# EasyEDA Pro project smart-switch-v1.eprj

# Schematic smart-switch-20a-main-board

## Sheets
1 main-board: Board Name: smart-switch-20a-main-board-v1; Create Date: 2025-08-24; Page Name: main-board; Project Name: smart-switch-v1; Schematic Name: smart-switch-20a-main-board; Update Date: 2025-09-30; Version: V1.0
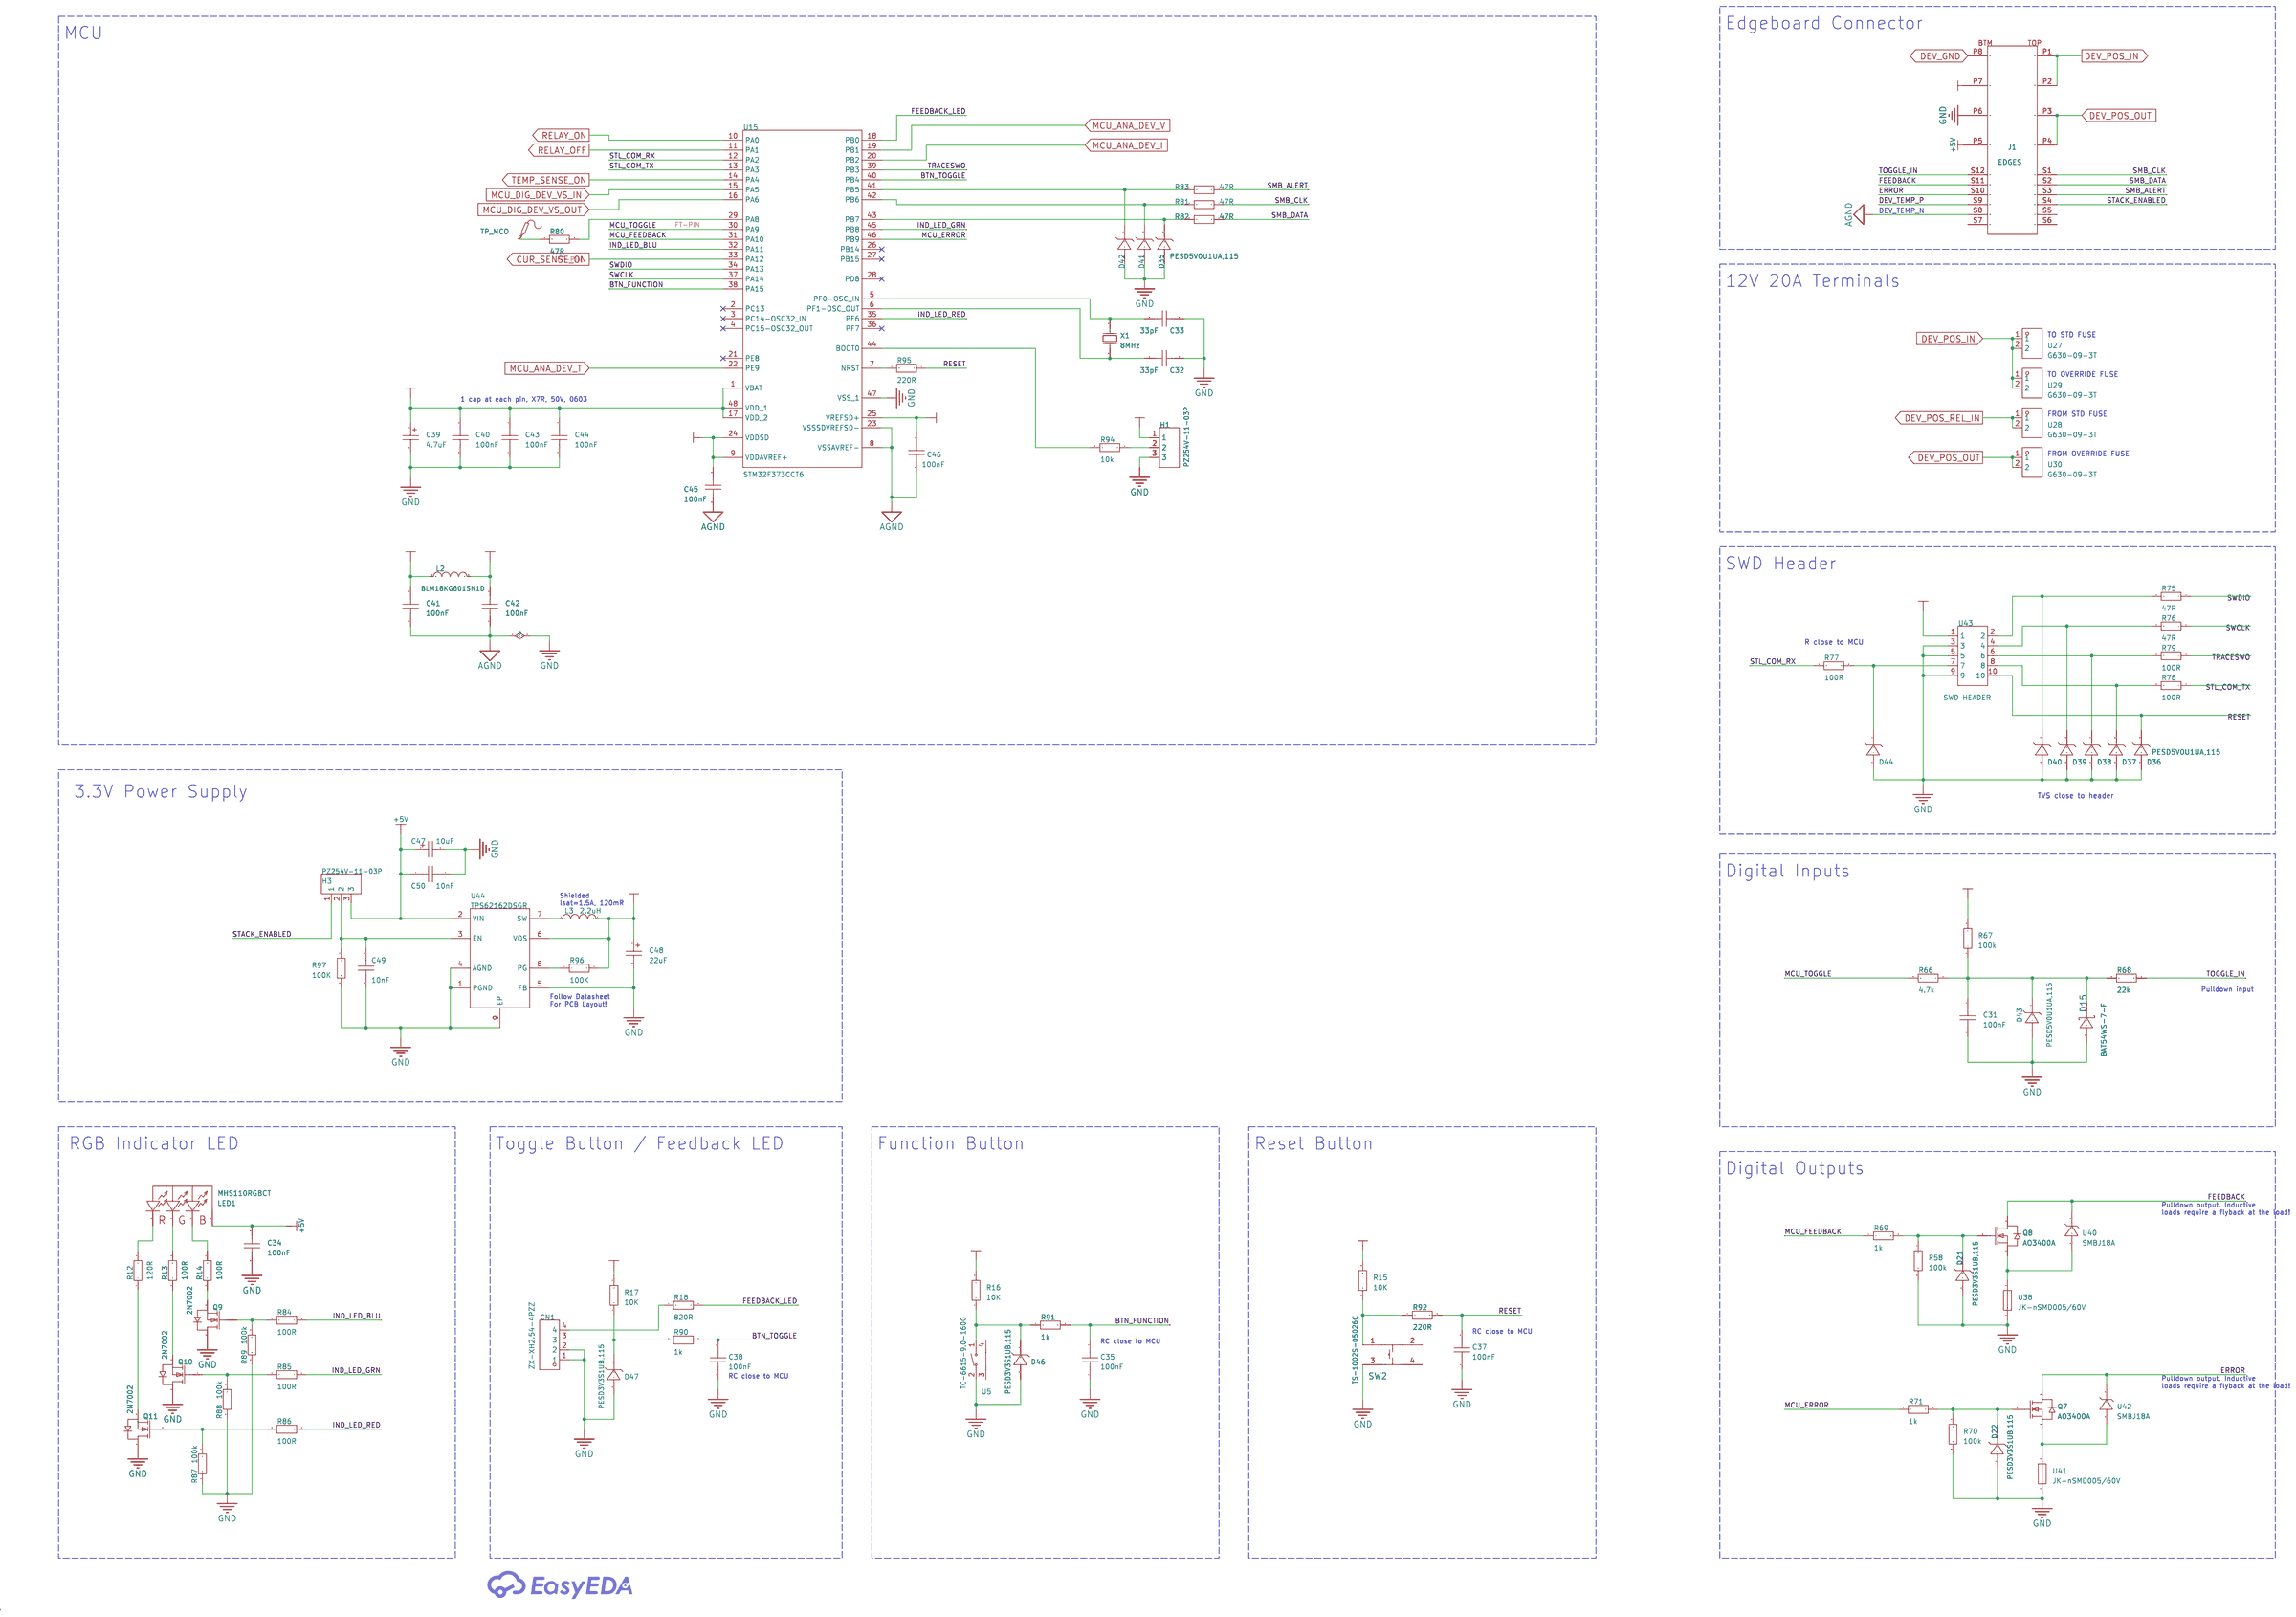
[diagram p0: main-board]
2 modules: Create Date: 2025-08-25; Page Name: modules; Update Date: 2025-09-28; Company: EasyEDA.com; Page Size: A4
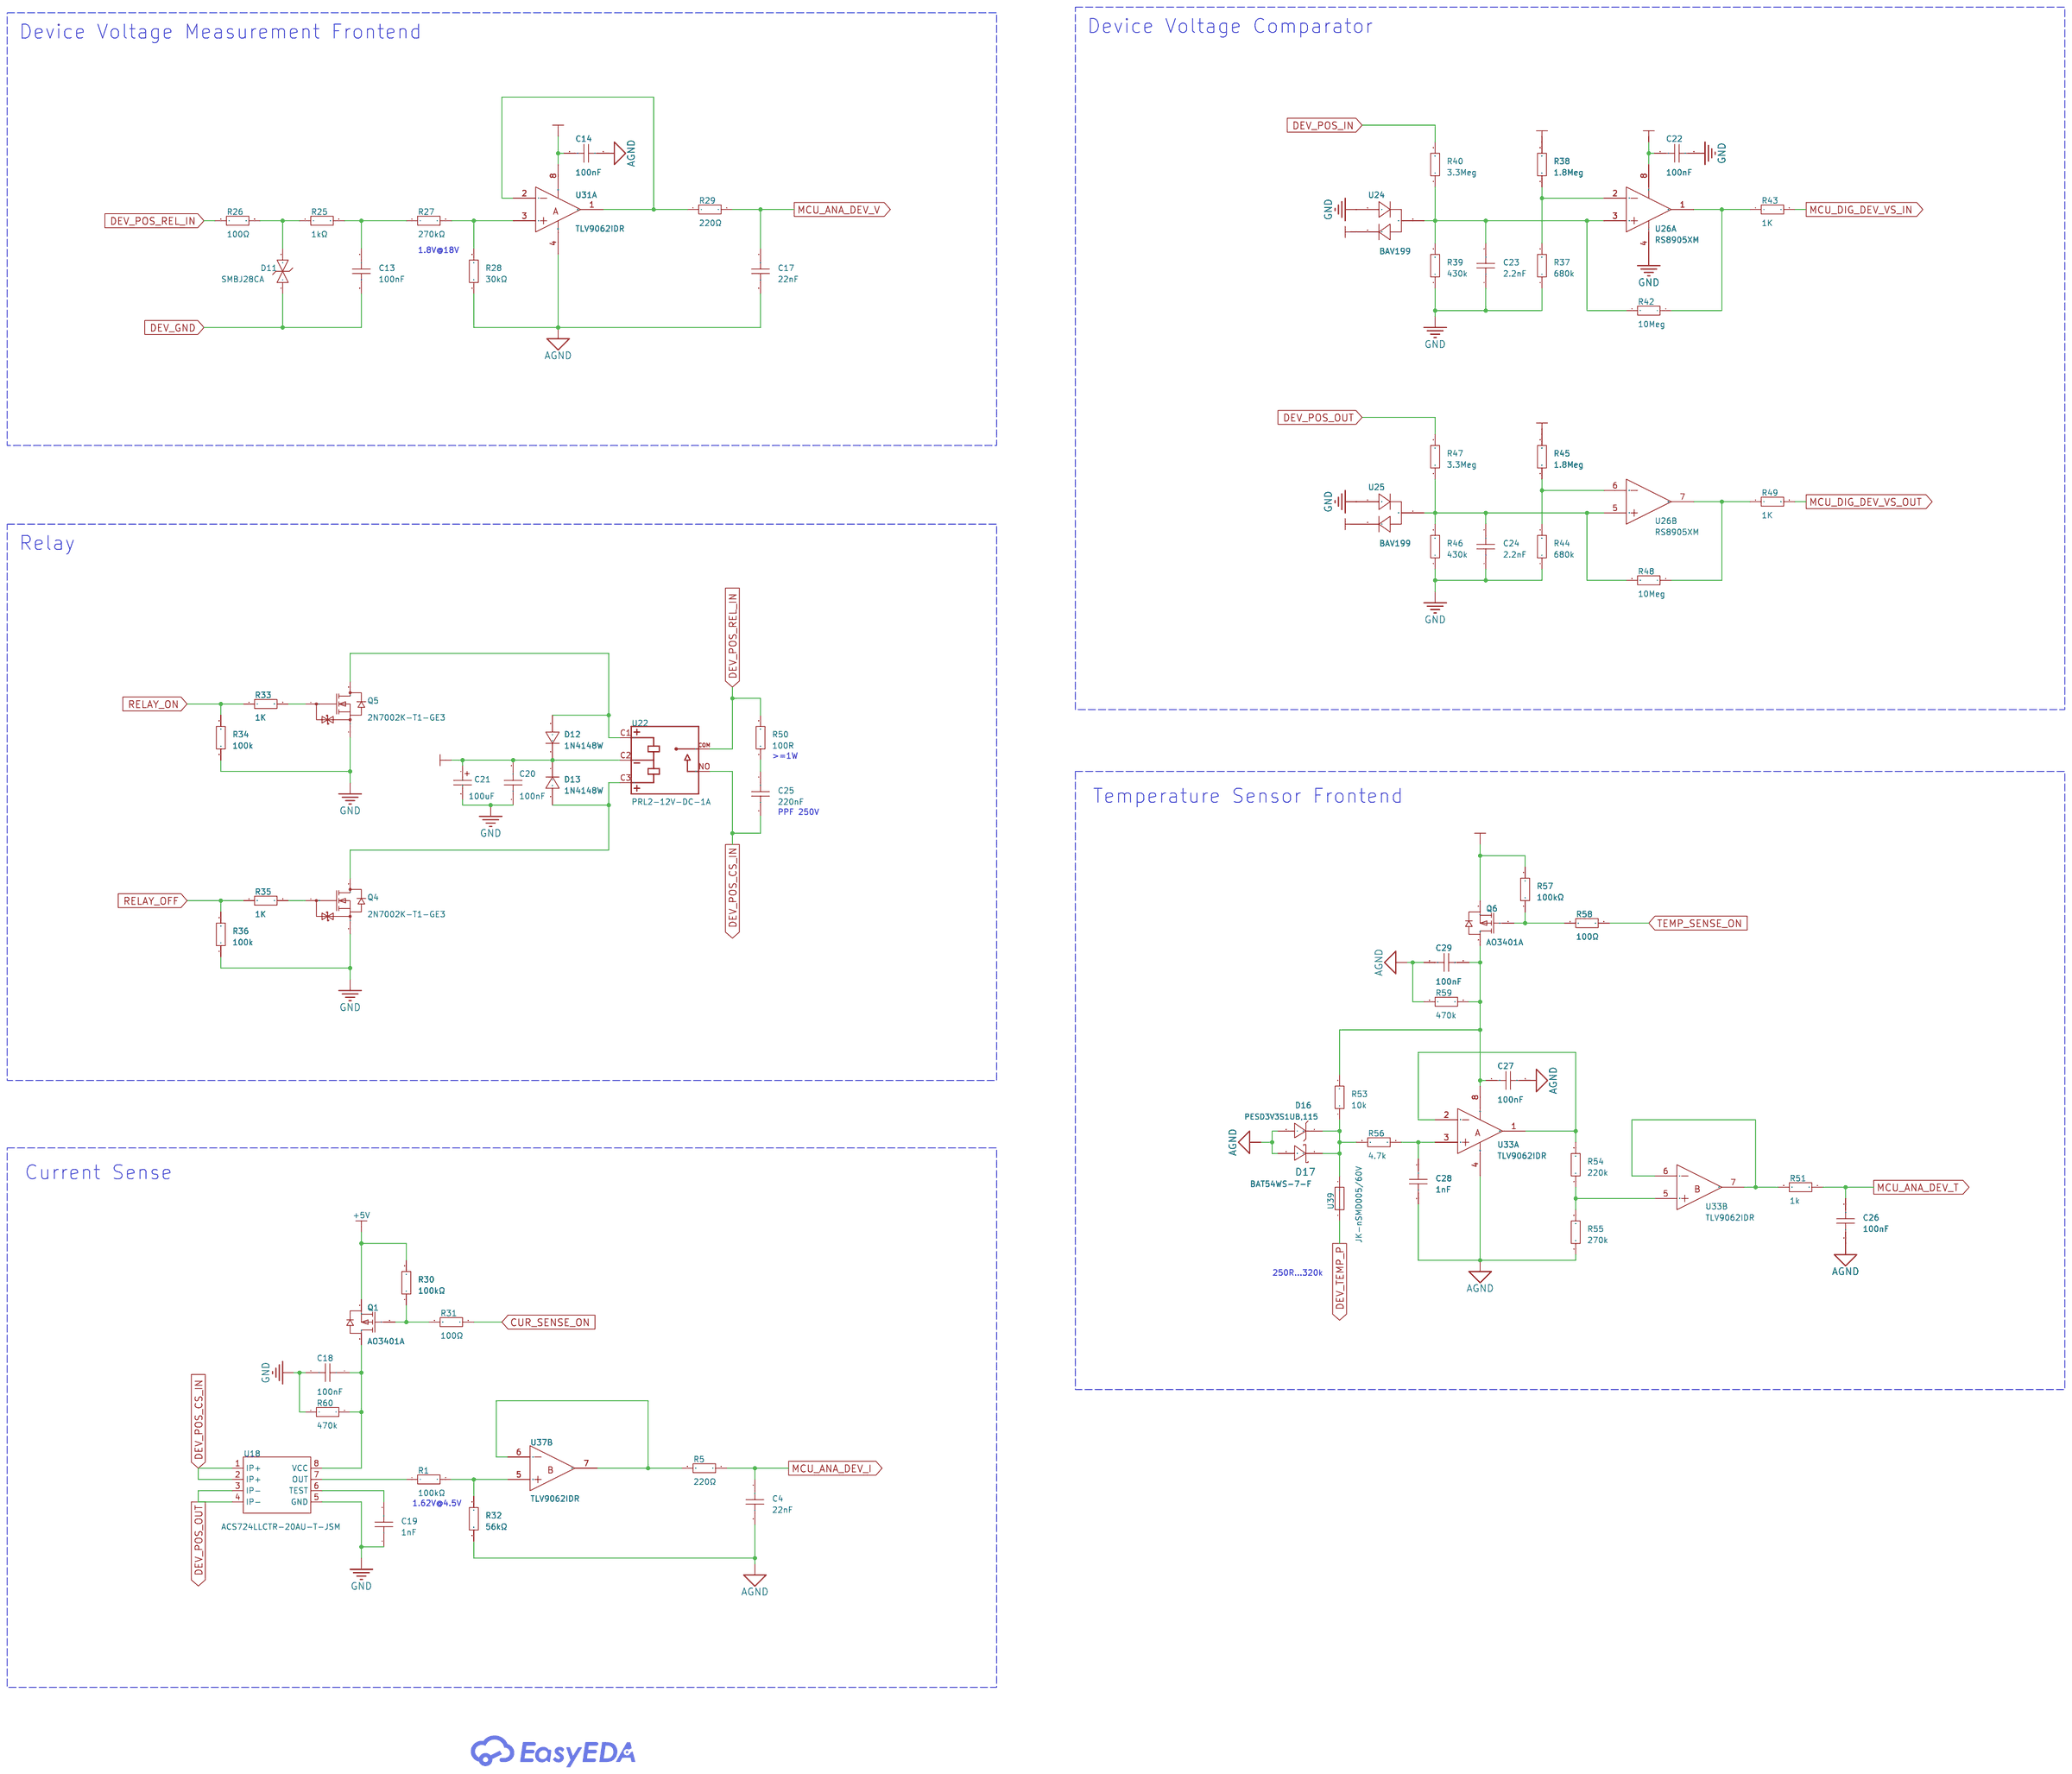
[diagram p1: modules]

## Parts
sheet main-board
C31  100nF  [C0201]
C32  33pF  [C0201]
C33  33pF  [C0201]
C34  100nF  [C0201]
C35  100nF  [C0201]
C37  100nF  [C0201]
C38  100nF  [C0201]
C39  4.7uF  [CAP-SMD_BD3.0-L3.3-W3.3-RD]
C40  100nF  [C0201]
C41  100nF  [C0201]
C42  100nF  [C0201]
C43  100nF  [C0201]
C44  100nF  [C0201]
C45  100nF  [C0201]
C46  100nF  [C0201]
C47  10uF  [CAP-SMD_BD3.0-L3.3-W3.3-RD]
C48  22uF  [CAP-SMD_BD3.0-L3.3-W3.3-RD]
C49  10nF  [C0201]
C50  10nF  [C0201]
CN1  ZX-XH2.54-4PZZ  [CONN-TH_4P-P2.50_4PIN]
D15  BAT54WS-7-F  [SOD-323_L1.8-W1.3-LS2.5-RD]
D21  PESD3V3S1UB,115  [SOD-523_L1.2-W0.8-LS1.6-RD]
D22  PESD3V3S1UB,115  [SOD-523_L1.2-W0.8-LS1.6-RD]
D35  PESD5V0U1UA,115  [SOD-323_L1.8-W1.3-LS2.5-RD]
D36  PESD5V0U1UA,115  [SOD-323_L1.8-W1.3-LS2.5-RD]
D37  PESD5V0U1UA,115  [SOD-323_L1.8-W1.3-LS2.5-RD]
D38  PESD5V0U1UA,115  [SOD-323_L1.8-W1.3-LS2.5-RD]
D39  PESD5V0U1UA,115  [SOD-323_L1.8-W1.3-LS2.5-RD]
D40  PESD5V0U1UA,115  [SOD-323_L1.8-W1.3-LS2.5-RD]
D41  PESD5V0U1UA,115  [SOD-323_L1.8-W1.3-LS2.5-RD]
D42  PESD5V0U1UA,115  [SOD-323_L1.8-W1.3-LS2.5-RD]
D43  PESD5V0U1UA,115  [SOD-323_L1.8-W1.3-LS2.5-RD]
D44  PESD5V0U1UA,115  [SOD-323_L1.8-W1.3-LS2.5-RD]
D46  PESD3V3S1UB,115  [SOD-523_L1.2-W0.8-LS1.6-RD]
D47  PESD3V3S1UB,115  [SOD-523_L1.2-W0.8-LS1.6-RD]
H1  PZ254V-11-03P  [HDR-TH_3P-P2.54-V-M]
H3  PZ254V-11-03P  [HDR-TH_3P-P2.54-V-M]
J1  EDGES  [1761786-edgeboard]
L2  BLM18KG601SN1D  [L0603]
L3  2.2uH  [L0402]
LED1  MHS110RGBCT  [LED-ARRAY-SMD_MHS110RGBCT]
Q7  AO3400A  [SOT-23-3_L2.9-W1.3-P1.90-LS2.4-BR]
Q8  AO3400A  [SOT-23-3_L2.9-W1.3-P1.90-LS2.4-BR]
Q9  2N7002  [SOT-23-3_L2.9-W1.3-P1.90-LS2.4-BR]
Q10  2N7002  [SOT-23-3_L2.9-W1.3-P1.90-LS2.4-BR]
Q11  2N7002  [SOT-23-3_L2.9-W1.3-P1.90-LS2.4-BR]
R12  120R  [R0603]
R13  100R  [R0603]
R14  100R  [R0603]
R15  10K  [R0603]
R16  10K  [R0603]
R17  10K  [R0603]
R18  820R  [R0603]
R58  100k  [R1206]
R66  4.7k  [R1206]
R67  100k  [R1206]
R68  22k  [R1206]
R69  1k  [R1206]
R70  100k  [R1206]
R71  1k  [R1206]
R75  47R  [R0603]
R76  47R  [R0603]
R77  100R  [R0603]
R78  100R  [R0603]
R79  100R  [R0603]
R80  47R  [R0603]
R81  47R  [R0603]
R82  47R  [R0603]
R83  47R  [R0603]
R84  100R  [R0603]
R85  100R  [R0603]
R86  100R  [R0603]
R87  100k  [R0603]
R88  100k  [R0603]
R89  100k  [R0603]
R90  1k  [R0603]
R91  1k  [R0603]
R92  220R  [R0603]
R94  10k  [R0603]
R95  220R  [R0603]
R96  100K  [R0603]
R97  100K  [R0603]
SW2  TS-1002S-05026C  [KEY-SMD_4P-L6.0-W6.0-P4.50-LS9.0]
TP_MCO  -  [Test-Point-0.5mm]
U5  TC-6615-9.0-160G  [KEY-TH_PTS645VXX83XLFS]
U15  STM32F373CCT6  [LQFP-48_L7.0-W7.0-P0.50-LS9.0-BL]
U27  G630-09-3T  [CONN-TH_2P-L8.2-W0.8-P5.10]
U28  G630-09-3T  [CONN-TH_2P-L8.2-W0.8-P5.10]
U29  G630-09-3T  [CONN-TH_2P-L8.2-W0.8-P5.10]
U30  G630-09-3T  [CONN-TH_2P-L8.2-W0.8-P5.10]
U38  JK-nSMD005/60V  [F1206]
U40  SMBJ18A  [SMB_L4.5-W3.6-LS5.4-RD]
U41  JK-nSMD005/60V  [F1206]
U42  SMBJ18A  [SMB_L4.5-W3.6-LS5.4-RD]
U43  SWD HEADER  [HDR-TH_10P-P1.27-V-M-R2-C5-S1.27]
U44  TPS62162DSGR  [WSON-8_L2.0-W2.0-P0.50-TL-EP]
X1  8MHz  [CRYSTAL-SMD_L5.0-W3.2]
sheet modules
C4  22nF  [C0201]
C13  100nF  [C0201]
C14  100nF  [C0201]
C17  22nF  [C0201]
C18  100nF  [C0201]
C19  1nF  [C0201]
C20  100nF  [C0201]
C21  100uF  [CAP-SMD_BD3.0-L3.3-W3.3-RD]
C22  100nF  [C0201]
C23  2.2nF  [C0201]
C24  2.2nF  [C0201]
C25  220nF  [C0201]
C26  100nF  [C0201]
C27  100nF  [C0201]
C28  1nF  [C0201]
C29  100nF  [C0201]
D11  SMBJ28CA  [SMB_L4.6-W3.6-LS5.3-BI]
D12  1N4148W  [SOD-123_L2.8-W1.8-LS3.7-RD]
D13  1N4148W  [SOD-123_L2.8-W1.8-LS3.7-RD]
D16  PESD3V3S1UB,115  [SOD-523_L1.2-W0.8-LS1.6-RD]
D17  BAT54WS-7-F  [SOD-323_L1.8-W1.3-LS2.5-RD]
Q1  AO3401A  [SOT-23_L2.9-W1.3-P1.90-LS2.4-BR]
Q4  2N7002K-T1-GE3  [SOT-23-3_L2.9-W1.6-P1.90-LS2.8-BR]
Q5  2N7002K-T1-GE3  [SOT-23-3_L2.9-W1.6-P1.90-LS2.8-BR]
Q6  AO3401A  [SOT-23_L2.9-W1.3-P1.90-LS2.4-BR]
R1  100kΩ  [R1206]
R5  220Ω  [RES-TH_BD2.5-L6.3-P10.30-D0.6]
R25  1kΩ  [R1206]
R26  100Ω  [R1206]
R27  270kΩ  [RES-TH_BD2.5-L6.3-P10.30-D0.6]
R28  30kΩ  [RES-TH_BD2.5-L6.3-P10.30-D0.6]
R29  220Ω  [RES-TH_BD2.5-L6.3-P10.30-D0.6]
R30  100kΩ  [R1206]
R31  100Ω  [R1206]
R32  56kΩ  [R1206]
R33  1K  [R0603]
R34  100k  [R0603]
R35  1K  [R0603]
R36  100k  [R0603]
R37  680k  [R0603]
R38  1.8Meg  [R0603]
R39  430k  [R0603]
R40  3.3Meg  [R0603]
R42  10Meg  [R0603]
R43  1K  [R0603]
R44  680k  [R0603]
R45  1.8Meg  [R0603]
R46  430k  [R0603]
R47  3.3Meg  [R0603]
R48  10Meg  [R0603]
R49  1K  [R0603]
R50  100R  [R1206]
R51  1k  [RES-TH_BD2.5-L6.3-P10.30-D0.6]
R53  10k  [R1206]
R54  220k  [R1206]
R55  270k  [R1206]
R56  4.7k  [RES-TH_BD2.5-L6.3-P10.30-D0.6]
R57  100kΩ  [R1206]
R58#2  100Ω  [R1206]
R59  470k  [RES-TH_BD2.5-L6.3-P10.30-D0.6]
R60  470k  [R1206]
U18  ACS724LLCTR-20AU-T-JSM  [SOP-8_L4.9-W3.9-P1.27-LS6.0-BL]
U22  PRL2-12V-DC-1A  [RELAY_PRL2-5V-DC-1A]
U24  BAV199  [SOT-23-3_L2.9-W1.3-P0.95-LS2.4-BR]
U25  BAV199  [SOT-23-3_L2.9-W1.3-P0.95-LS2.4-BR]
U26  RS8905XM  [MSOP-8_L3.0-W3.0-P0.65-LS4.9-BL]  (sections 1,2)
U31  TLV9062IDR  [SOIC-8_L5.0-W4.0-P1.27-LS6.0-BL]  (section 1)
U33  TLV9062IDR  [SOIC-8_L5.0-W4.0-P1.27-LS6.0-BL]  (sections 1,2)
U37  TLV9062IDR  [SOIC-8_L5.0-W4.0-P1.27-LS6.0-BL]  (section 2)
U39  JK-nSMD005/60V  [F1206]

## Library data of the parts
C4 C13 C14 C17-C20 C22-C29 C31-C35 C37 C38 C40-C46 C49 C50 = CAP_0201: Supplier Footprint: 0201
C21 C39 C47 C48 = C_Ele_SMD_3x5.4mm: Supplier Footprint: SMD,3x5.4mm
CN1 = ZX-XH2.54-4PZZ: LCSC Part Name: 1x4P 间距:2.5mm 直插 系列:XH; Supplier Part: C7429634; Manufacturer: Megastar(兆星); Supplier Footprint: 插件,P=2.5mm; JLCPCB Part Class: Extended Part; Datasheet: https://item.szlcsc.com/datasheet/ZX-XH2.54-4PZZ/8427551.html; Supplier: LCSC; Pins Structure: 1x4P; Pitch: 2.5mm; Mounting Type: Through Hole; Reference Series: XH; Number of Pins: 4P; Number of Rows: 1; Number of PINs Per Row: 4; Current Rating: 3A; Contact Material: Brass; Contact Plating: Tin; Operating Temperature: -25℃~+85℃; Voltage Rating: 250V; Plastic Material: PA66; Flame Retardant Rating: UL94V-0; Color: White; Z-Height of the Board: 7mm; X-Length of Bottom Edge on Board (Spacing Line): 12.5mm; Y-Width of Bottom Edge on Board: 5.9mm
D15 D17 = BAT54WS-7-F: LCSC Part Name: 电压:30V 电流:100mA; Supplier Part: C124205; Manufacturer: DIODES(美台); Supplier Footprint: SOD-323; JLCPCB Part Class: Extended Part; Datasheet: https://item.szlcsc.com/datasheet/BAT54WS-7-F/125480.html; Supplier: LCSC; Voltage - Forward(Vf@If): 1V@100mA; Voltage - DC Reverse(Vr): 30V; Current - Rectified: 100mA; Reverse Leakage Current (Ir): 2uA@25V; Non-Repetitive Peak Forward Surge Current: 600mA
D16 D21 D22 D46 D47 = PESD3V3S1UB,115: LCSC Part Name: 单向ESD; Supplier Part: C85377; Manufacturer: Nexperia(安世); Supplier Footprint: SC-79(SOD-523); JLCPCB Part Class: Extended Part; Datasheet: https://item.szlcsc.com/datasheet/PESD3V3S1UB%252C115/86550.html; Supplier: LCSC; Polarity: Unidirectional; Reverse Stand-Off Voltage (Vrwm): 3.3V; Clamping Voltage: 20V; Peak Pulse Current (Ipp): 18A; Peak Pulse Power Dissipation (Ppp): 330W; Voltage - Breakdown: 5.2V; Number of Channels: 1; Operating Temperature: -65℃~+150℃@(Ta); Type: ESD
D35-D44 = PESD5V0U1UA,115: LCSC Part Name: 单向ESD; Supplier Part: C139614; Manufacturer: Nexperia(安世); Supplier Footprint: SOD-323; JLCPCB Part Class: Extended Part; Datasheet: https://item.szlcsc.com/datasheet/PESD5V0U1UA%252C115/150939.html; Supplier: LCSC; Polarity: Unidirectional; Reverse Stand-Off Voltage (Vrwm): 5V; Clamping Voltage: 11V; Peak Pulse Current (Ipp): 1.3A@8/20us; Voltage - Breakdown: 8.8V; Reverse Leakage Current (Ir): 1nA; Number of Channels: 1; Operating Temperature: -55℃~+150℃@(Ta); level of protection: IEC 61000-4-2; Type: ESD; Junction Capacitance: 2pF
H1 H3 = PZ254V-11-03P: LCSC Part Name: 1x3P 间距:2.54mm 方针 直插; Supplier Part: C2937625; Manufacturer: XFCN(兴飞); Supplier Footprint: 插件,P=2.54mm; JLCPCB Part Class: Extended Part; Datasheet: https://item.szlcsc.com/datasheet/PZ254V-11-03P/3293280.html; Supplier: LCSC; Pin Structure: 1x3P; Pitch: 2.54mm; Circluar Pins/Square Pins: Pin Header; Mounting Type: Through Hole; Number of Rows: 1; Number of Pins: 3P; Current Rating: 3A; Voltage Rating (Max): 250V; Length of Mating Pin: 6mm; Insulation Height: 2.5mm; Length of End Connection Pin: 3mm; Operating Temperature: -40℃~+105℃; Color: Black
J1 = 1761786-edgecon
L2 = BLM18KG601SN1D: LCSC Part Name: 单路 0603磁珠 阻抗600Ω@100MHz; Supplier Part: C85833; Manufacturer: muRata(村田); Supplier Footprint: 0603; JLCPCB Part Class: Extended Part; Datasheet: https://item.szlcsc.com/datasheet/BLM18KG601SN1D/87009.html; Supplier: LCSC; Impedance @ Frequency: 600Ω@100MHz; Tolerance: ±25%; DC Resistance(DCR): 150mΩ; Current Rating: 1.3A; Number of Circuits: 1; Operating Temperature: -55℃~+125℃
L3 = L_0402
LED1 = MHS110RGBCT: LCSC Part Name: RGB三色 侧贴; Supplier Part: C389528; Manufacturer: MEIHUA(美华); Supplier Footprint: SMD,1.5x3mm; JLCPCB Part Class: Extended Part; Datasheet: https://atta.szlcsc.com/upload/public/pdf/source/20190530/C389528_18CC971B89683121AF99AD38EE2CA1FC.pdf; Supplier: LCSC
Q7 Q8 = AO3400A_C20917: LCSC Part Name: 1个N沟道 耐压:30V 电流:5.7A; Supplier Part: C20917; Manufacturer: AOS; Supplier Footprint: SOT-23-3L; JLCPCB Part Class: Basic Part; Datasheet: https://item.szlcsc.com/datasheet/AO3400A/21629.html; Supplier: LCSC; Drain to Source Voltage: 30V; RDS(on): 48mΩ@2.5V; Gate Threshold Voltage (Vgs(th)): 1.45V@250uA; Gate Charge(Qg): 7nC@10V; Input Capacitance(Ciss): 630pF@15V; Operating Temperature: -55℃~+150℃@(Tj); Type: N-Channel
Q9-Q11 = 2N7002_C8545: LCSC Part Name: 1个N沟道 耐压:60V 电流:115mA; Supplier Part: C8545; Manufacturer: CJ(江苏长电/长晶); Supplier Footprint: SOT-23; JLCPCB Part Class: Basic Part; Datasheet: https://item.szlcsc.com/datasheet/2N7002/9040.html; Supplier: LCSC; Number: 1 N-Channel; Drain to Source Voltage: 60V; Current - Continuous Drain(Id): 115mA; RDS(on): 5Ω@10V; Pd - Power Dissipation: 225mW; Gate Threshold Voltage (Vgs(th)): 2.5V; Input Capacitance(Ciss): 50pF; Reverse Transfer Capacitance (Crss@Vds): 5pF
R12-R18 R33-R40 R42-R49 R75-R92 R94-R97 = Res_0603: Supplier Footprint: 0603
R1 R25 R26 R30-R32 R53-R55 R57 R58 R58#2 R60 R69-R71 = CRCW1206100RFKEAHP: Type:Thick Film Resistors Resistance: Tolerance:±1% Tolerance:±1% Power(Watts): Temperature Coefficient:±100ppm/℃ Temperature Coefficient:±100ppm/℃ Operating Temperature:-55℃~+155℃ Operating Temperature:-55℃~+155℃; LCSC Part Name: 厚膜电阻 100Ω ±1% 750mW; Supplier Part: C844642; Manufacturer: VISHAY(威世); Supplier Footprint: 1206; JLCPCB Part Class: Extended Part; Datasheet: https://atta.szlcsc.com/upload/public/pdf/source/20221018/EBA0766182E7785923AA75C06FB4488F.pdf; Supplier: LCSC; Type: Thick Film Resistors; Tolerance: ±1%; Temperature Coefficient: ±100ppm/℃; Operating Temperature: -55℃~+155℃
R50 R66-R68 = Res_1206: Supplier Footprint: 1206
SW2 = TS-1002S-05026C: LCSC Part Name: 6*6*5mm 立贴 轻触开关; Supplier Part: C455110; Manufacturer: XUNPU(讯普); Supplier Footprint: SMD,6x6mm; JLCPCB Part Class: Extended Part; Datasheet: https://atta.szlcsc.com/upload/public/pdf/source/20250513/F8F0C18C3D0EDC07DAC80A3CC3CDA783.pdf; Supplier: LCSC; Circuit: SPST; Actuator Style: Round Button; Mounting Type: Vertical welding; Length: 6mm; Width: 6mm; Switch Height: 5mm; Contact Current: 50mA; Voltage Rating: 12V
TP_MCO = Test-Point
U5 = TC-6615-9.0-160G: LCSC Part Name: 6*6*9mm 卧插 轻触开关; Supplier Part: C6575016; Manufacturer: HCTL(华灿天禄); Supplier Footprint: 插件; JLCPCB Part Class: Extended Part; Datasheet: https://atta.szlcsc.com/upload/public/pdf/source/20230523/20C79B748B4ACB531A66068A8A6BD305.pdf; Supplier: LCSC; Circuit: SPST; Actuator Style: Round Button; Operating Force: 160gf; Mounting Style: Horizontal Plug; Switch Length: 6mm; Switch Width: 6mm; Switch Height: 9mm; Strike Gundam: With bracket; Contact Current: 50mA; Voltage Rating (DC): 12V; Insulation Resistance: 100MΩ; Actuator/Cap Color: Black; With Lamp: None; Mechanical Life: 100000 Times; Operating Temperature: -25℃~+85℃
U15 = STM32F373CCT6: LCSC Part Name: ARMCortex-M4 32b MCU+FPU，Flash+SRAM，定时器，ADC，DAC，比较器，2.0 - 3.6V; Supplier Part: C89403; Manufacturer: ST(意法半导体); Supplier Footprint: LQFP-48(7x7); JLCPCB Part Class: Extended Part; Datasheet: https://atta.szlcsc.com/upload/public/pdf/source/20241127/8B6F308DCC530FE270436E313305134C.pdf; Supplier: LCSC; CPU Core: ARM-M4; CPU Maximum Speed: 72MHz; Program Storage Size: 256KB; Program Memory Type: FLASH; Number of I/O: 36; ADC (Bit): 16bit；12bit; DAC (Bit): 12bit; Voltage - Supply: 2V~3.6V
U27-U30 = G630-09-3T: LCSC Part Name: 6.3mmPCB焊接端子-插片; Supplier Part: C27636945; Manufacturer: SAMZO(三佐); Supplier Footprint: 插件; JLCPCB Part Class: Extended Part; Datasheet: https://item.szlcsc.com/datasheet/G630-09-3T/29374908.html; Supplier: LCSC
U38 U39 U41 = JK-nSMD005/60V: LCSC Part Name: 60V 0.05A 1206自恢复; Supplier Part: C2830235; Manufacturer: JK(金科); Supplier Footprint: 1206; JLCPCB Part Class: Extended Part; Datasheet: https://item.szlcsc.com/datasheet/JK-nSMD005%252F60V/2981864.html; Supplier: LCSC; Voltage - Max: 60V; Current - Max: 100A; Hold Current: 50mA; Trip Current: 150mA; Resistance - Initial (Ri) (Min): 3.6Ω; Resistance - Post Trip (R1) (Max): 50Ω; Time to Trip(Max): 1.5s; Operating Temperature: -40℃~+85℃
U40 U42 = SMBJ18A_C19077573: LCSC Part Name: 单向TVS 18V截止 峰值浪涌电流：20.55A@10/1000us; Supplier Part: C19077573; Manufacturer: R+O(宏嘉诚); Supplier Footprint: DO-214AA(SMB); JLCPCB Part Class: Extended Part; Datasheet: https://item.szlcsc.com/datasheet/SMBJ18A/20275658.html; Supplier: LCSC; Polarity: Unidirectional; Reverse Stand-Off Voltage (Vrwm): 18V; Clamping Voltage: 29.2V; Peak Pulse Current (Ipp): 20.55A@10/1000us; Peak Pulse Power Dissipation (Ppp): 600W@10/1000us; Voltage - Breakdown: 22.1V; Reverse Leakage Current (Ir): 5uA; Operating Temperature: -55℃~+150℃; level of protection: IEC 61000-4-2; Type: TVS
U43 = ZX-PZ1.27-2-5PZZ: LCSC Part Name: 2x5P 间距:1.27mm 方针 直插; Supplier Part: C7501289; Manufacturer: Megastar(兆星); Supplier Footprint: 插件,P=1.27mm; JLCPCB Part Class: Extended Part; Datasheet: https://item.szlcsc.com/datasheet/ZX-PZ1.27-2-5PZZ/8582502.html; Supplier: LCSC; Pin Structure: 2x5P; Pitch: 1.27mm; Row Spacing: 1.27mm; Circluar Pins/Square Pins: Pin Header; Mounting Type: Through Hole; Number of Rows: 2; Number of Pins: 10P; Current Rating: 1A; Length of Mating Pin: 3.9mm; Insulation Height: 1mm; Length of End Connection Pin: 2.3mm; Contact Material: Brass; Contact Plating: Gold; Operating Temperature: -40℃~+105℃; Color: Black
U44 = TPS62162DSGR: Function:Step-down type Output Type:- Voltage - Supply:3V~17V Voltage - Supply:3V~17V Output Voltage:- Output Voltage:- Output Current:1A Frequency - Switching:2.25MHz Frequency - Switching:2.25MHz Operating Temperature:-40℃~+125℃@(TJ) Operating Temperatu; LCSC Part Name: TPS62162DSGR同步降压DC-DC转换器; Supplier Part: C40256; Manufacturer: TI(德州仪器); Supplier Footprint: WSON-8-EP(2x2); JLCPCB Part Class: Extended Part; Datasheet: https://www.ti.com/cn/lit/gpn/tps62162; Supplier: LCSC; Function: Step-down type; Voltage - Supply: 3V~17V; Output Current: 1A; Frequency - Switching: 2.25MHz; Operating Temperature: -40℃~+125℃@(TJ); Synchronous Rectifier: Yes; Number of Outputs: 1; Topology: Step-down; Switch tube (built-in/external): Built-in
X1 = X50328MSB2GI: LCSC Part Name: YSX530GA 8MHZ 2P 5032 20PF ±10PPM -40~85℃ (±20PPM); Supplier Part: C115962; Manufacturer: YXC(扬兴晶振); Supplier Footprint: SMD5032-2P; JLCPCB Part Class: Basic Part; Datasheet: https://item.szlcsc.com/datasheet/X50328MSB2GI/117214.html; Supplier: LCSC; Type: Crystal Oscillator; Normal temperature Frequency Tolerance: ±10ppm; Load Capacitance: 20pF; Frequency Stability: ±20ppm; Operating Temperature: -40℃~+85℃
D11 = SMBJ28CA_C726872: LCSC Part Name: 双向TVS 28V截止 峰值浪涌电流：13.3A@10/1000us; Supplier Part: C726872; Manufacturer: TWGMC(迪嘉); Supplier Footprint: DO-214AA(SMB); JLCPCB Part Class: Extended Part; Datasheet: https://item.szlcsc.com/datasheet/SMBJ28CA/773977.html; Supplier: LCSC; Polarity: Bidirectional; Reverse Stand-Off Voltage (Vrwm): 28V; Clamping Voltage: 45.4V; Peak Pulse Current (Ipp): 13.3A@10/1000us; Peak Pulse Power Dissipation (Ppp): 600W@10/1000us; Voltage - Breakdown: 34.4V; Reverse Leakage Current (Ir): 1uA; Operating Temperature: -65℃~+150℃; Type: TVS; Junction Capacitance: 390pF
D12 D13 = 1N4148W_C2099: LCSC Part Name: 丝印T4 1N4148W; Supplier Part: C2099; Manufacturer: CJ(江苏长电/长晶); Supplier Footprint: SOD-123; JLCPCB Part Class: Extended Part; Datasheet: https://item.szlcsc.com/datasheet/1N4148W/2456.html; Supplier: LCSC; Diode Configuration: Independent; Voltage - Forward(Vf@If): 1.25V@150mA; Voltage - DC Reverse(Vr): 100V; Current - Rectified: 150mA; Pd - Power Dissipation: 500mW; Reverse Leakage Current (Ir): 1uA@75V; Reverse Recovery Time (trr): 4ns; Non-Repetitive Peak Forward Surge Current: 2A
Q1 Q6 = AO3401A_C15127: LCSC Part Name: 1个P沟道 耐压:30V 电流:4A; Supplier Part: C15127; Manufacturer: AOS; Supplier Footprint: SOT-23; JLCPCB Part Class: Basic Part; Datasheet: https://item.szlcsc.com/datasheet/AO3401A/15801.html; Supplier: LCSC; Number: 1 P-Channel; Drain to Source Voltage: 30V; Current - Continuous Drain(Id): 4A; RDS(on): 47mΩ@10V；85mΩ@2.5V；60mΩ@4.5V; Gate Threshold Voltage (Vgs(th)): 900mV@250uA; Gate Charge(Qg): 14nC@10V; Input Capacitance(Ciss): 645pF; Reverse Transfer Capacitance (Crss@Vds): 55pF; Output Capacitance(Coss): 80pF
Q4 Q5 = 2N7002K-T1-GE3: LCSC Part Name: 1个N沟道 耐压:60V 电流:300mA; Supplier Part: C81445; Manufacturer: VISHAY(威世); Supplier Footprint: SOT-23; JLCPCB Part Class: Extended Part; Datasheet: https://item.szlcsc.com/datasheet/2N7002K-T1-GE3/82596.html; Supplier: LCSC; Number: 1 N-Channel; Drain to Source Voltage: 60V; Current - Continuous Drain(Id): 300mA; RDS(on): 2Ω@10V,500mA; Pd - Power Dissipation: 350mW; Gate Threshold Voltage (Vgs(th)): 2.5V; Gate Charge(Qg): 600pC@10V; Reverse Transfer Capacitance (Crss@Vds): 2.5pF@10V; Operating Temperature: -55℃~+150℃
R5 R27-R29 R51 R56 R59 = MBB0207VD1004BC100: Type:Metal Film Resistor Resistance:1MΩ Tolerance:±0.1% Tolerance:±0.1% Power(Watts):400mW Temperature Coefficient:±25ppm/℃ Temperature Coefficient:±25ppm/℃ Operating Temperature:- Operating Temperature:-; LCSC Part Name: 金属膜电阻 1MΩ ±0.1% 400mW; Supplier Part: C1365008; Manufacturer: VISHAY(威世); Supplier Footprint: 插件,D2.5xL6.3mm; JLCPCB Part Class: Extended Part; Datasheet: https://item.szlcsc.com/datasheet/MBB0207VD1004BC100/1455296.html; Supplier: LCSC; Type: Metal Film Resistor; Tolerance: ±0.1%; Power(Watts): 400mW; Temperature Coefficient: ±25ppm/℃
U18 = ACS724LLCTR-20AU-T-JSM: Supplier Part: C46596282; Manufacturer: JSMSEMI(杰盛微); Supplier Footprint: SOP-8; JLCPCB Part Class: Extended Part; Datasheet: https://item.szlcsc.com/datasheet/ACS724LLCTR-20AU-T-JSM/48736594.html; Supplier: LCSC
U22 = PRL2-12V-DC-1A
U24 U25 = BAV199_C5184419: Supplier Part: C5184419; Manufacturer: HXY MOSFET(华轩阳电子); Supplier Footprint: SOT-23; JLCPCB Part Class: Extended Part; Datasheet: https://item.szlcsc.com/datasheet/BAV199/5849855.html; Supplier: LCSC; Diode Configuration: 1 Pair Series Connection; Voltage - Forward(Vf@If): 1.25V@150mA; Voltage - DC Reverse(Vr): 70V; Current - Rectified: 215mA; Pd - Power Dissipation: 200mW; Reverse Leakage Current (Ir): 5nA@75V; Reverse Recovery Time (trr): 3us; Operating Junction Temperature Range: -55℃~+150℃; Non-Repetitive Peak Forward Surge Current: 1A
U26 = RS8905XM: LCSC Part Name: 微功耗比较器RS8905; Supplier Part: C5372656; Manufacturer: RUNIC(润石); Supplier Footprint: MSOP-8; JLCPCB Part Class: Extended Part; Datasheet: https://atta.szlcsc.com/upload/public/pdf/source/20230316/E9133064EE9D2ADCDC7D3DD82EE4887D.pdf; Supplier: LCSC; Number of Channels: 2; Vos - Input Offset Voltage: 3mV; Ib - Input Bias Current: 1pA; Propagation Delay Time: 9us; Output Type: TTL；CMOS; Rail to Rail: Rail-to-Rail Input, Rail-to-Rail Output; Quiescent Current: 400nA; Operating Temperature: -40℃~+125℃
U31 U33 U37 = TLV9062IDR: LCSC Part Name: 适用于成本敏感型系统的10MHz、轨到轨输入输出（RRIO）CMOS运算放大器; Supplier Part: C398355; Manufacturer: TI(德州仪器); Supplier Footprint: SOIC-8; JLCPCB Part Class: Extended Part; Datasheet: https://www.ti.com/cn/lit/gpn/tlv9061; Supplier: LCSC; Number of Channels: 2; Maximum Power Supply Range (Vdd-Vss): 9V; Vos - Input Offset Voltage: 1.6mV; Input Offset Voltage Drift(Vos TC): 0.53uV/℃; Slew Rate: 6.5V/us; Ib - Input Bias Current: 0.5pA; Noise density(eN): 10nV/√Hz@1kHz; Common Mode Rejection Ratio(CMRR): 103dB; Operating Temperature: -40℃~+125℃; Single supply: 1.8V~5.5V

## Nets
+3V3: C22.1 C39.1 C40.1 C41.2 C43.1 C44.1 C48.1 H1.1 L2.1 L3.2 R15.2 R16.2 R17.2 R38.2 R45.2 R67.2 R96.2 U15.1(VBAT) U15.17(VDD_2) U15.48(VDD_1) U24.2 U25.2 U26.8(V+) U43.1 U44.6(VOS)
+5V: C34.1 C47.1 C50.1 H3.3 J1.P5(27) LED1.2(+) Q1.2(S) R30.2 U44.2(VIN)
+12V: C20.2 C21.1 D12.1(K) D13.1(K) J1.P7(33) U22.C2(COIL2)
AGND: C4.2 C14.2 C17.2 C18.2 C19.1 C20.1 C21.2 C22.2 C23.1 C24.1 C26.2 C27.2 C28.2 C29.2 C31.1 C32.1 C33.1 C34.2 C35.1 C37.1 C38.1 C39.2 C40.2 C41.1 C42.1 C43.2 C44.2 C45.2 C46.2 C47.2 C48.2 C49.2 C50.2 CN1.1 CN1.2 D15.2 D16.2(A) D17.2 D21.2(A) D22.2(A) D35.2(A) D36.2(A) D37.2(A) D38.2(A) D39.2(A) D40.2(A) D41.2(A) D42.2(A) D43.2(A) D44.2(A) D46.2(A) D47.2(A) H1.3 J1.P6(30) J1.S8(20) Q4.2(S) Q5.2(S) Q9.3(D) Q10.3(D) Q11.3(D) R28.1 R32.1 R34.1 R36.1 R37.1 R39.1 R44.1 R46.1 R55.1 R58.2 R59.2 R60.1 R70.2 R87.2 R88.2 R89.2 R97.2 SW2.3 U5.2 U15.8(VSSAVREF-) U15.23(VSSSDVREFSD-) U15.47(VSS_1) U18.5(GND) U24.1 U25.1 U26.4(V-) U31.4(VEE/GND) U33.4(VEE/GND) U38.1 U41.1 U43.3 U43.5 U43.9 U44.1(PGND) U44.4(AGND) U44.5(FB) U44.9(EP)
VDDA: C14.1 C42.2 C45.1 C46.1 L2.2 Q6.2(S) R57.2 U15.9(VDDAVREF+) U15.24(VDDSD) U15.25(VREFSD+) U31.8(VCC)
BTN_FUNCTION: C35.2 R91.2 U15.38(PA15)
BTN_TOGGLE: C38.2 R90.2 U15.40(PB4)
CUR_SENSE_ON: R31.1 U15.33(PA12)
DEV_GND: C13.2 D11.1 J1.P8(36)
DEV_POS_CS_IN: C25.2 U18.1(IP+) U18.2(IP+) U22.NO
DEV_POS_IN: J1.P1 J1.P2 R40.2 U27.1 U27.2 U29.1 U29.2
DEV_POS_OUT: J1.P3 J1.P4 R47.2 U18.3(IP-) U18.4(IP-) U30.1 U30.2
DEV_POS_REL_IN: R26.1 R50.2 U22.COM U28.1 U28.2
DEV_TEMP_P: J1.S9(21) U39.1
ERROR: J1.S10(22) Q7.3(D) U42.1(C)
FEEDBACK: J1.S11(23) Q8.3(D) U40.1(C)
FEEDBACK_LED: R18.2 U15.18(PB0)
IND_LED_BLU: R84.2 U15.32(PA11)
IND_LED_GRN: R85.1 U15.45(PB8)
IND_LED_RED: R86.1 U15.35(PF6)
MCU_ANA_DEV_I: C4.1 R5.1 U15.20(PB2)
MCU_ANA_DEV_T: C26.1 R51.1 U15.22(PE9)
MCU_ANA_DEV_V: C17.1 R29.1 U15.19(PB1)
MCU_DIG_DEV_VS_IN: R43.2 U15.15(PA5)
MCU_DIG_DEV_VS_OUT: R49.2 U15.16(PA6)
MCU_ERROR: R71.1 U15.46(PB9)
MCU_FEEDBACK: R69.1 U15.31(PA10)
MCU_TOGGLE: R66.2 U15.30(PA9)
RELAY_OFF: R35.1 R36.2 U15.11(PA1)
RELAY_ON: R33.1 R34.2 U15.10(PA0)
RESET: C37.2 D36.1(C) R92.2 R95.1 U43.10
SMB_ALERT: J1.S3(15) R83.1
SMB_CLK: J1.S1(13) R81.1
SMB_DATA: J1.S2(14) R82.1
STACK_ENABLED: H3.1 J1.S4(16)
STL_COM_RX: R77.1 U15.12(PA2)
STL_COM_TX: R78.1 U15.13(PA3)
SWCLK: R76.1 U15.37(PA14)
SWDIO: R75.1 U15.34(PA13)
TEMP_SENSE_ON: R58#2.1 U15.14(PA4)
TOGGLE_IN: J1.S12(24) R68.1
TRACESWO: R79.1 U15.39(PB3)
Net-(C13-1): C13.1 R25.2 R27.1
Net-(C18-1): C18.1 Q1.3(D) R60.2 U18.8(VCC)
Net-(C19-2): C19.2 U18.6(TEST)
Net-(C23-2): C23.2 R39.2 R40.1 R42.2 U24.3 U26.3(INA+)
Net-(C24-2): C24.2 R46.2 R47.1 R48.2 U25.3 U26.5(INB+)
Net-(C25-1): C25.1 R50.1
Net-(C27-1): C27.1 C29.1 Q6.3(D) R53.2 R59.1 U33.8(VCC)
Net-(C28-1): C28.1 R56.1 U33.3(INA+)
Net-(C31-2): C31.2 D15.1 D43.1(C) R66.1 R67.1 R68.2
Net-(C32-2): C32.2 U15.6(PF1-OSC_OUT) X1.1(OSC1)
Net-(C33-2): C33.2 U15.5(PF0-OSC_IN) X1.2(OSC2)
Net-(C49-1): C49.1 H3.2 R97.1 U44.3(EN)
Net-(CN1-3): CN1.3 D47.1(C) R17.1 R90.1
Net-(CN1-4): CN1.4 R18.1
Net-(D11-2): D11.2 R25.1 R26.2
Net-(D12-2): D12.2(A) Q5.3(D) U22.C1(COIL1)
Net-(D13-2): D13.2(A) Q4.3(D) U22.C3(COIL3)
Net-(D16-1): D16.1(C) D17.1 R53.1 R56.2 U39.2
Net-(D21-1): D21.1(C) Q8.1(G) R58.1 R69.2
Net-(D22-1): D22.1(C) Q7.1(G) R70.1 R71.2
Net-(D35-1): D35.1(C) R82.2 U15.43(PB7)
Net-(D37-1): D37.1(C) R78.2 U43.8
Net-(D38-1): D38.1(C) R79.2 U43.6
Net-(D39-1): D39.1(C) R76.2 U43.4
Net-(D40-1): D40.1(C) R75.2 U43.2
Net-(D41-1): D41.1(C) R81.2 U15.42(PB6)
Net-(D42-1): D42.1(C) R83.2 U15.41(PB5)
Net-(D44-1): D44.1(C) R77.2 U43.7
Net-(D46-1): D46.1(C) R16.1 R91.1 U5.1
Net-(H1-2): H1.2 R94.1
Net-(L3-1): L3.1 U44.7(SW)
Net-(LED1-1): LED1.1(-) R14.2
Net-(LED1-3): LED1.3(-) R12.2
Net-(LED1-4): LED1.4(-) R13.2
Net-(Q1-1): Q1.1(G) R30.1 R31.2
Net-(Q4-1): Q4.1(G) R35.2
Net-(Q5-1): Q5.1(G) R33.2
Net-(Q6-1): Q6.1(G) R57.1 R58#2.2
Net-(Q7-2): Q7.2(S) U41.2 U42.2(A)
Net-(Q8-2): Q8.2(S) U38.2 U40.2(A)
Net-(Q9-1): Q9.1(G) R84.1 R89.1
Net-(Q9-2): Q9.2(S) R14.1
Net-(Q10-1): Q10.1(G) R85.2 R88.1
Net-(Q10-2): Q10.2(S) R13.1
Net-(Q11-1): Q11.1(G) R86.2 R87.1
Net-(Q11-2): Q11.2(S) R12.1
Net-(R1-1): R1.1 U18.7(OUT)
Net-(R1-2): R1.2 R32.2 U37.5(INB+)
Net-(R5-2): R5.2 U37.6(INB-) U37.7(OUTB)
Net-(R15-1): R15.1 R92.1 SW2.1
Net-(R27-2): R27.2 R28.2 U31.3(INA+)
Net-(R29-2): R29.2 U31.1(OUTA) U31.2(INA-)
Net-(R37-2): R37.2 R38.1 U26.2(INA-)
Net-(R42-1): R42.1 R43.1 U26.1(OUTA)
Net-(R44-2): R44.2 R45.1 U26.6(INB-)
Net-(R48-1): R48.1 R49.1 U26.7(OUTB)
Net-(R51-2): R51.2 U33.6(INB-) U33.7(OUTB)
Net-(R54-1): R54.1 R55.2 U33.5(INB+)
Net-(R54-2): R54.2 U33.1(OUTA) U33.2(INA-)
Net-(R80-1): R80.1 TP_MCO.1
Net-(R80-2): R80.2 U15.29(PA8)
Net-(R94-2): R94.2 U15.44(BOOT0)
Net-(R95-2): R95.2 U15.7(NRST)
Net-(R96-1): R96.1 U44.8(PG)

Not connected (* = marked no-connect by the designer): J1 S5(17) S6(18) S7(19); SW2 2 4; U5 3 4; U15 2(PC13)* 3(PC14-OSC32_IN)* 4(PC15-OSC32_OUT)* 21(PE8)* 26(PB14)* 27(PB15)* 28(PD8)* 36(PF7)*

## Notes on the sheets
sheet 1
- Edgeboard Connector
- MCU
- DEV_TEMP_N
- FT-PIN
- FT-PIN
- 12V 20A Terminals
- TO STD FUSE
- TO OVERRIDE FUSE
- 1 cap at each pin, X7R, 50V, 0603
- FROM STD FUSE
- FROM OVERRIDE FUSE
- SWD Header
- R close to MCU
- 3.3V Power Supply
- TVS close to header
- Digital Inputs
- Shielded
  lsat=1.5A, 120mR
- Pulldown input
- Follow Datasheet
  For PCB Layout!
- RGB Indicator LED
- Toggle Button / Feedback LED
- Function Button
- Reset Button
- Digital Outputs
- Pulldown output. Inductive
  loads require a flyback at the load!
- RC close to MCU
- RC close to MCU
- RC close to MCU
- Pulldown output. Inductive
  loads require a flyback at the load!
sheet 2
- Device Voltage Comparator
- Device Voltage Measurement Frontend
- 1.8V@18V
- Relay
- >=1W
- Temperature Sensor Frontend
- PPF 250V
- Current Sense
- 250R...320k
- 1.62V@4.5V

# Schematic base-board-20A
Board Name: smart-switch-20A-base-board-v1; Create Date: 2025-08-31; Page Name: P1; Project Name: smart-switch-v1; Schematic Name: base-board-20A; Update Date: 2025-10-02; Company: EasyEDA.com; Page Size: A4; Version: V1.0
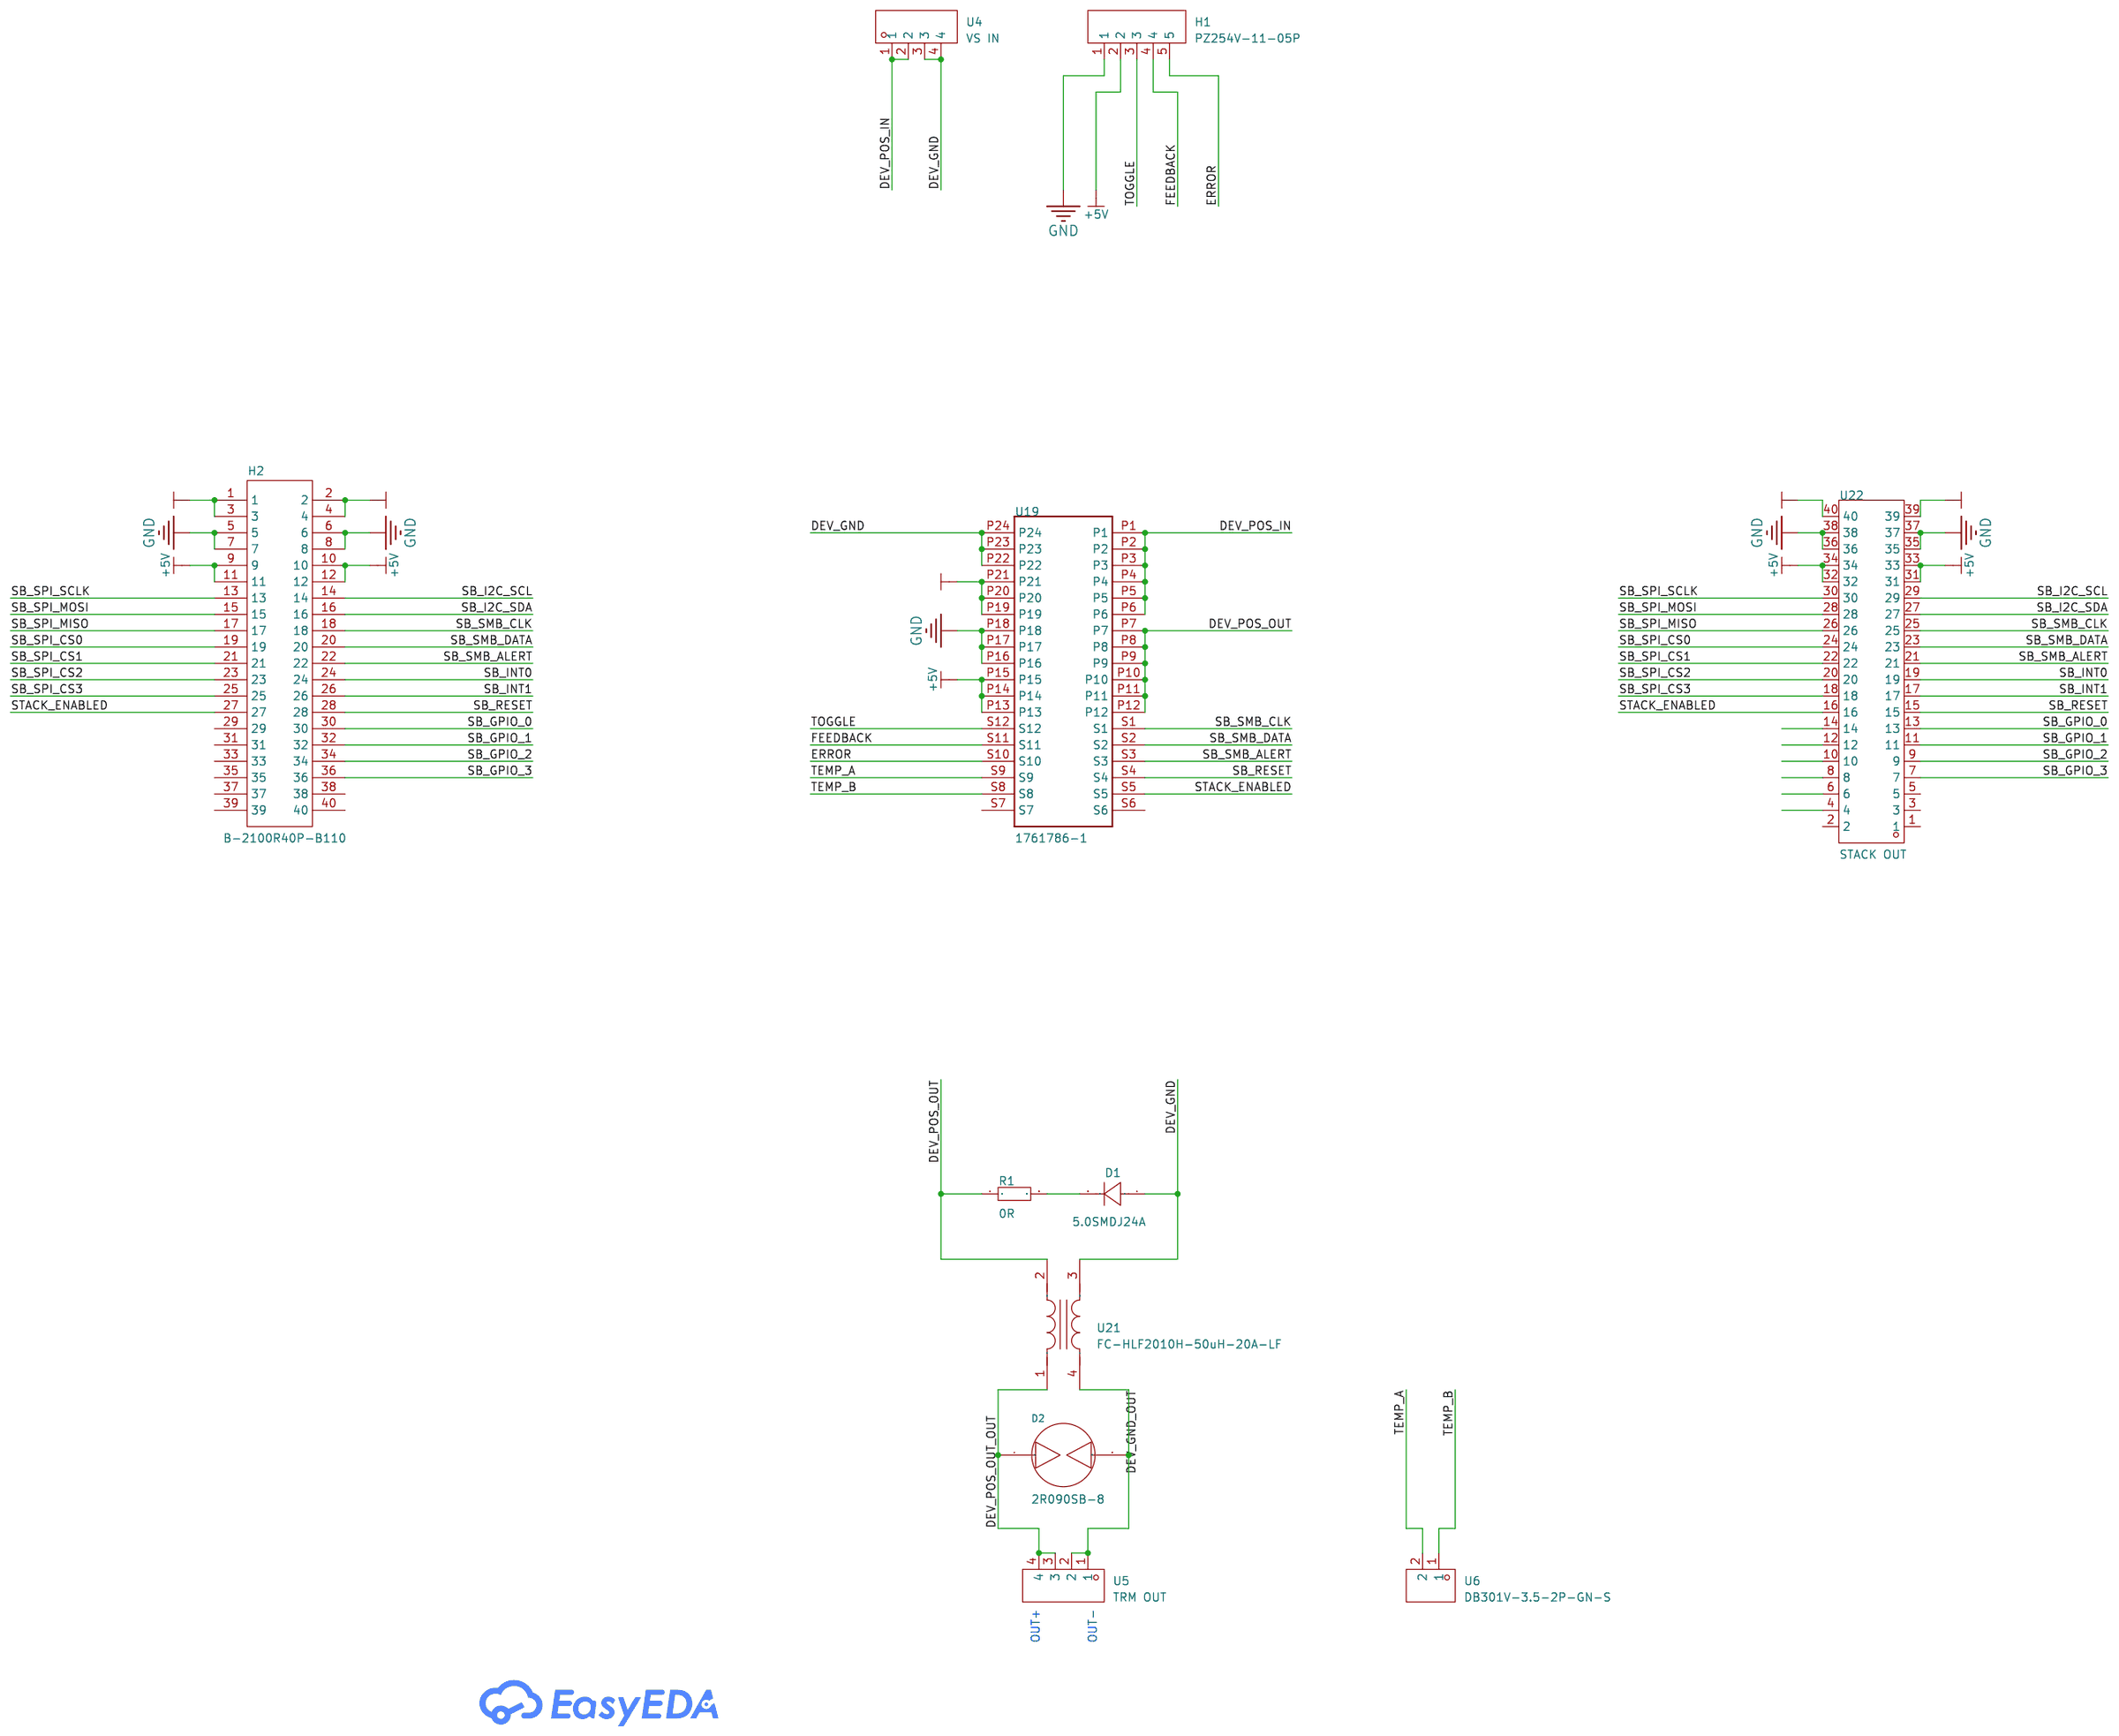
[diagram p2: schematic sheet]

## Parts
D1  5.0SMDJ24A  [SMC_L6.9-W5.9-LS7.9-R-RD]
D2  2R090SB-8  [DIO-DT-SMD_L8.0-W6.0]
H1  PZ254V-11-05P  [HDR-TH_5P-P2.54-V-M]
H2  B-2100R40P-B110  [HDR-TH_40P-P2.54-H-R2-C20-S2.54-W10.0]
R1  0R  [R0603]
U4  VS IN  [CONN-TH_4P-P7.62_DB910-7.62-4P-GN-S]
U5  TRM OUT  [CONN-TH_4P-P7.62_DB910-7.62-4P-GN-S]
U6  DB301V-3.5-2P-GN-S  [CONN-TH_DB301V-3.5-2P-GN]
U19  1761786-1  [17617861]
U21  FC-HLF2010H-50uH-20A-LF  [FILTER-TH_4P-L21.5-W14.0-TL]
U22  STACK OUT  [HDR-TH_40P-P2.54-H-F-R2-C20-S2.54-N]

## Library data of the parts
D1 = 5.0SMDJ24A_C3151722: Supplier Part: C3151722; Manufacturer: PAKER(派克微); Supplier Footprint: SMC; JLCPCB Part Class: Extended Part; Datasheet: https://atta.szlcsc.com/upload/public/pdf/source/20220607/733F7EF8A256C9AB9E3BF6EBC63A8845.pdf; Supplier: LCSC
D2 = 2R090SB-8_C485316: LCSC Part Name: 蓝色 90V 10kA 2端 贴片GDT; Supplier Part: C485316; Manufacturer: RUILON(瑞隆源); Supplier Footprint: SMD,8x6mm; JLCPCB Part Class: Extended Part; Datasheet: https://atta.szlcsc.com/upload/public/pdf/source/20240308/A22709EDC0C5EA70272A3A3AE26A64A5.pdf; Supplier: LCSC; Voltage - DC Spark Over (Nom): 90V; Tolerance: ±20%; Impulse Discharge Current: 10kA; inter-electrode capacitance: 1.5pF
H1 = PZ254V-11-05P: LCSC Part Name: 1x5P 间距:2.54mm 方针 直插; Supplier Part: C492404; Manufacturer: XFCN(兴飞); Supplier Footprint: 插件,P=2.54mm; JLCPCB Part Class: Extended Part; Datasheet: https://atta.szlcsc.com/upload/public/pdf/source/20200309/C492404_E51533260F8710EFF5D4617281164C1D.pdf; Supplier: LCSC; Pin Structure: 1x5P; Pitch: 2.54mm; Circluar Pins/Square Pins: Policy; Mounting Type: Straight; Number of Rows: Single Row; Number of Pins: 5P; Length of Mating Pin: 6mm; Insulation Height: 2.5mm; Length of End Connection Pin: 3mm; Contact Material: Brass; Operating Temperature: -40℃~+105℃; Color: Black
H2 = B-2100R40P-B110: LCSC Part Name: 2x20P 间距:2.54mm 弯插; Supplier Part: C124369; Manufacturer: Ckmtw(灿科盟); Supplier Footprint: 弯插,P=2.54mm; JLCPCB Part Class: Extended Part; Datasheet: https://item.szlcsc.com/datasheet/B-2100R40P-B110/125644.html; Supplier: LCSC; Pin Structure: 2x20P; Pitch: 2.54mm; Row Spacing: 2.54mm; Mounting Type: Right Angle; Number of Rows: 2; Number of Pins: 40P; Length of Mating Pin: 6mm; Insulation Height: 2.54mm; Contact Material: Brass; Operating Temperature: -40℃~+105℃; Color: Black
R1 = Res_0603: Supplier Footprint: 0603
U4 U5 = DB910-7.62-4P-GN-S: LCSC Part Name: 1x4P 7.62mm 直插 排数:1 每排P数:4; Supplier Part: C430614; Manufacturer: DORABO(地博电气); Supplier Footprint: 插件,P=7.62mm; JLCPCB Part Class: Extended Part; Datasheet: https://atta.szlcsc.com/upload/public/pdf/source/20230321/25C062544AAD8C6953E556DE350F8F26.pdf; Supplier: LCSC; Number of Positions or Pins: 1x4P; Pitch: 7.62mm; Color: Green; Mounting Type: Through Hole; Number of Pins: 4P; Number of Rows: 1; Number of PINs Per Row: 4; Screw Specification: M3; Current Rating: 30A; Voltage Rating (Max): 300V; Operating Temperature: -40℃~+105℃
U6 = DB301V-3.5-2P-GN-S: LCSC Part Name: 1x2P 3.5mm 直插 排数:1 每排P数:2; Supplier Part: C695629; Manufacturer: DORABO(地博电气); Supplier Footprint: 插件,P=3.5mm; JLCPCB Part Class: Extended Part; Datasheet: https://item.szlcsc.com/datasheet/DB301V-3.5-2P-GN-S/728965.html; Supplier: LCSC; Number of Positions or Pins: 1x2P; Pitch: 3.5mm; Color: Green; Mounting Type: Through Hole; Number of Pins: 2P; Number of Rows: 1; Number of PINs Per Row: 2; Screw Specification: M2; Current Rating: 7A; Voltage Rating (Max): 300V; Operating Temperature: -40℃~+105℃
U19 = 1761786-1
U21 = FC-HLF2010H-50uH-20A-LF: LCSC Part Name: 输出共模电感; Supplier Part: C7421066; Manufacturer: FC(方成); Supplier Footprint: DIP; JLCPCB Part Class: Extended Part; Datasheet: https://item.szlcsc.com/datasheet/FC-HLF2010H-50uH-20A-LF/8400613.html; Supplier: LCSC; Number of Lines: 2; Voltage Withstand: 1.5kV; Current Rating: 20A; Inductance @ Frequency: 50uH; DC Resistance(DCR): 2mΩ; Operating Temperature: -40℃~+125℃; Insulation Resistance(IR): 100MΩ
U22 = HC-PM254-8.5H-2x20PW: LCSC Part Name: 间距2.54mm 2x20Pin 弯插 PC3.2 PB12.7 H8.5; Supplier Part: C22373943; Manufacturer: HC(虹成电子); Supplier Footprint: 弯插,P=2.54mm; JLCPCB Part Class: Extended Part; Datasheet: https://item.szlcsc.com/datasheet/HC-PM254-8.5H-2x20PW/23870280.html; Supplier: LCSC; Holes Structure: 2x20P; Pitch: 2.54mm; Row Spacing: 2.54mm; Circular Hole / Square Hole: Square Hole; Mounting Type: Right Angle; Number of Rows: 2; Number of Positions: 40P; Current Rating: 3A; Holes Direction: Side; Insulation Height: 5mm; Contact Material: Brass; Contact Plating: Gold; Operating Temperature: -40℃~+105℃; PIN Length: 3mm

## Nets
+5V: H1.2 H2.9 H2.10 H2.11 H2.12 U19.P13 U19.P14 U19.P15 U22.31 U22.32 U22.33 U22.34
+12V: H2.1 H2.2 H2.3 H2.4 U19.P19 U19.P20 U19.P21 U22.39 U22.40
GND: H1.1 H2.5 H2.6 H2.7 H2.8 U19.P16 U19.P17 U19.P18 U22.35 U22.36 U22.37 U22.38
DEV_GND: D1.1(A) U4.3 U4.4 U19.P22 U19.P23 U19.P24 U21.3
DEV_GND_OUT: D2.2 U5.1 U5.2 U21.4
DEV_POS_IN: U4.1 U4.2 U19.P1 U19.P2 U19.P3 U19.P4 U19.P5 U19.P6
DEV_POS_OUT: R1.1 U19.P7 U19.P8 U19.P9 U19.P10 U19.P11 U19.P12 U21.2
DEV_POS_OUT_OUT: D2.1 U5.3 U5.4 U21.1
ERROR: H1.5 U19.S10
FEEDBACK: H1.4 U19.S11
SB_GPIO_0: H2.30 U22.13
SB_GPIO_1: H2.32 U22.11
SB_GPIO_2: H2.34 U22.9
SB_GPIO_3: H2.36 U22.7
SB_I2C_SCL: H2.14 U22.29
SB_I2C_SDA: H2.16 U22.27
SB_INT0: H2.24 U22.19
SB_INT1: H2.26 U22.17
SB_RESET: H2.28 U19.S4 U22.15
SB_SMB_ALERT: H2.22 U19.S3 U22.21
SB_SMB_CLK: H2.18 U19.S1 U22.25
SB_SMB_DATA: H2.20 U19.S2 U22.23
SB_SPI_CS0: H2.19 U22.24
SB_SPI_CS1: H2.21 U22.22
SB_SPI_CS2: H2.23 U22.20
SB_SPI_CS3: H2.25 U22.18
SB_SPI_MISO: H2.17 U22.26
SB_SPI_MOSI: H2.15 U22.28
SB_SPI_SCLK: H2.13 U22.30
STACK_ENABLED: H2.27 U19.S5 U22.16
TEMP_A: U6.2 U19.S9
TEMP_B: U6.1 U19.S8
TOGGLE: H1.3 U19.S12
$1N15655: D1.2(K) R1.2

Not connected (* = marked no-connect by the designer): H2 29 31 33 35 37 38 39 40; U19 S6 S7; U22 1 2 3 4 5 6 8 10 12 14

## Notes on the sheet
- OUT+
- OUT-

# Board PCB6
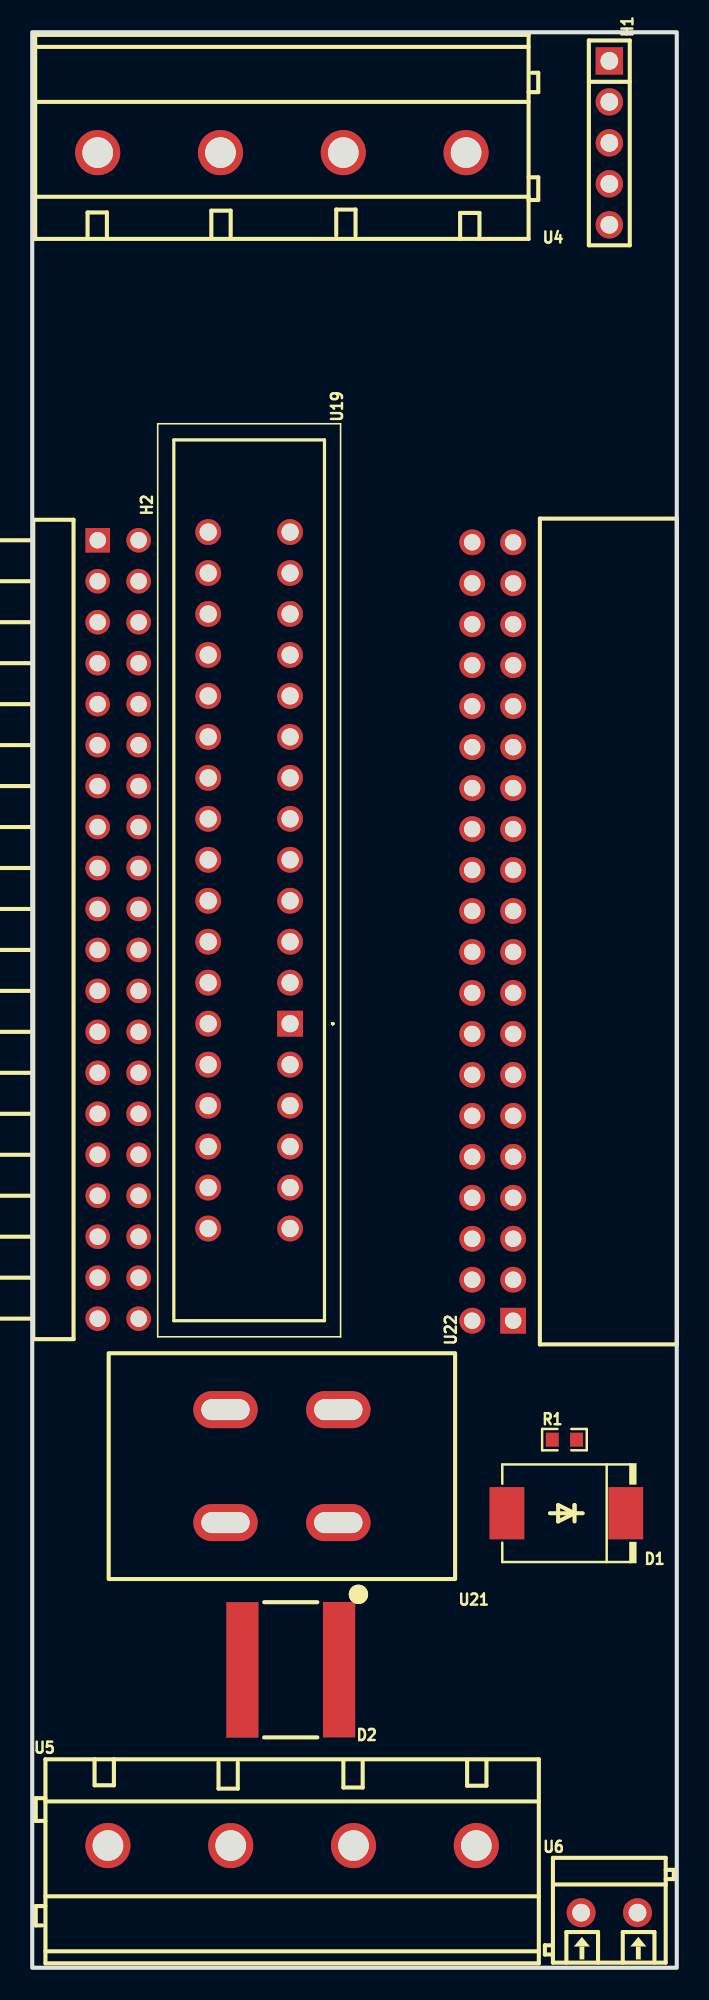
[diagram p3: board, top side]
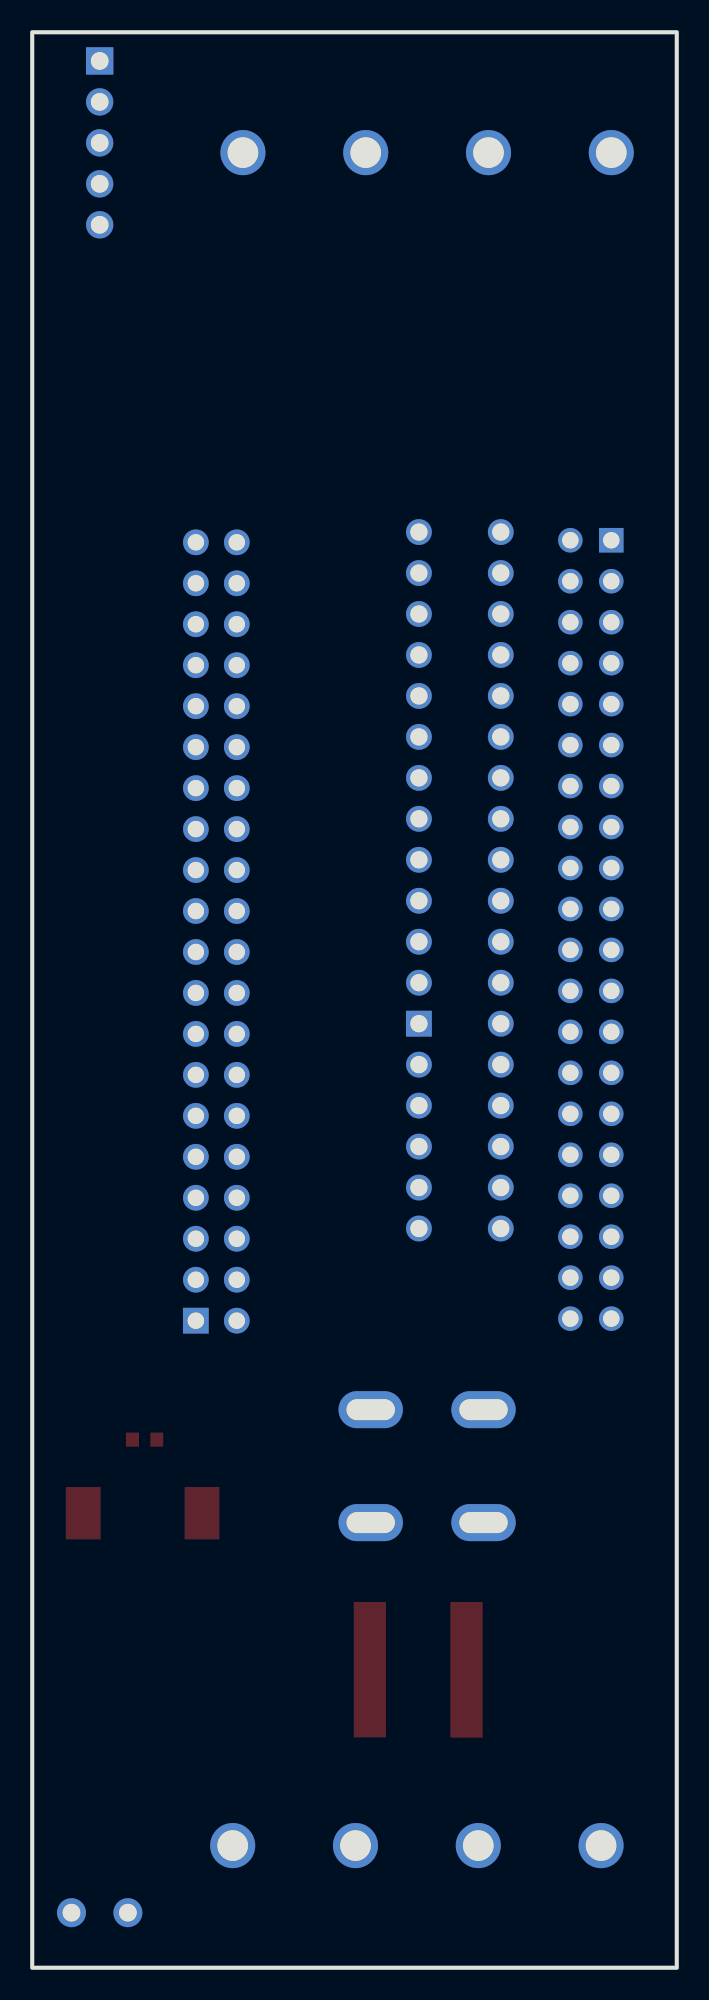
[diagram p4: board, bottom side, seen from below]

Outline 40 x 120 mm; copper layers: Top Layer, Bottom Layer. Coordinates in mm from the lower left corner of the outline.
Outline path: rectangle 0,120 40,0
Stack: Top Layer 0.035mm / Dielectric1 1.51mm FR4 er 4.5 / Bottom Layer 0.035mm

## Design rules (mm)
template: JLCPCB Capability(Two Layers Board)
spacing copperThickness1oz (default): track to track 0.102, other pairs 0.152 to 0.3
spacing copperThickness2oz: track to track 0.203, other pairs 0.152 to 0.3
track width copperThickness1oz (default): min 0.127, default 0.254, max 2.54
track width copperThickness2oz: min 0.203, default 0.254, max 2.54
differential pair differentialPair (default): width min 0.127, default 0.254, max 2.54; gap min 0.152, default 0.152
via viaSize (default): diameter min 0.5, default 0.61, max 10; hole min 0.3, default 0.305, max 6.3

## Placement (name value [footprint] x y rotation side)
D1  5.0SMDJ24A  [SMC_L6.9-W5.9-LS7.9-R-RD]  33.15 28.18 180 top
D2  2R090SB-8  [DIO-DT-SMD_L8.0-W6.0]  16.04 18.47 180 top
H1  PZ254V-11-05P  [HDR-TH_5P-P2.54-V-M]  35.81 113.14 270 top
H2  B-2100R40P-B110  [HDR-TH_40P-P2.54-H-R2-C20-S2.54-W10.0]  5.33 64.37 270 top
R1  0R  [R0603]  33.03 32.74 0 top
U4  VS IN  [CONN-TH_4P-P7.62_DB910-7.62-4P-GN-S]  15.49 112.89 180 top
U5  TRM OUT  [CONN-TH_4P-P7.62_DB910-7.62-4P-GN-S]  16.13 7.22 0 top
U6  DB301V-3.5-2P-GN-S  [CONN-TH_DB301V-3.5-2P-GN]  35.81 3.41 0 top
U19  1761786-1  [17617861]  16 58.53 270 top
U21  FC-HLF2010H-50uH-20A-LF  [FILTER-TH_4P-L21.5-W14.0-TL]  15.49 31.1 180 top
U22  STACK OUT  [HDR-TH_40P-P2.54-H-F-R2-C20-S2.54-N]  28.57 64.25 90 top

## Footprints (pads in the part's own frame, mm; a bottom-side part is the same pattern mirrored in y, then rotated)
17617861
  round 1.605 hole 1.07: P1(-30.48,0) P2(-27.94,0) P3(-25.4,0) P4(-22.86,0) P5(-20.32,0) P6(-17.78,0) P7(-15.24,0) P8(-12.7,0) P9(-10.16,0) P10(-7.62,0) P11(-5.08,0) P12(-2.54,0) P13(-2.54,-5.08) P14(-5.08,-5.08) P15(-7.62,-5.08) P16(-10.16,-5.08) P17(-12.7,-5.08) P18(-15.24,-5.08) P19(-17.78,-5.08) P20(-20.32,-5.08) P21(-22.86,-5.08) P22(-25.4,-5.08) P23(-27.94,-5.08) P24(-30.48,-5.08) S2(2.54,0) S3(5.08,0) S4(7.62,0) S5(10.16,0) S6(12.7,0) S7(12.7,-5.08) S8(10.16,-5.08) S9(7.62,-5.08) S10(5.08,-5.08) S11(2.54,-5.08) S12(0,-5.08)
  rect 1.605x1.605 hole 1.07: S1(0,0)
CONN-TH_4P-P7.62_DB910-7.62-4P-GN-S
  round 2.8 hole 1.9: 1(-11.43,0.35) 2(-3.81,0.35) 3(3.81,0.35) 4(11.43,0.35)
CONN-TH_DB301V-3.5-2P-GN
  round 1.8 hole 1.1: 1(-1.75,0) 2(1.75,0)
DIO-DT-SMD_L8.0-W6.0
  rect 2x8.4 smd: 1(-3,-0.006) 2(3,0.006)
FILTER-TH_4P-L21.5-W14.0-TL
  oval 4x2.3 hole 3x1.3: 1(-3.5,3.5) 2(-3.5,-3.5) 3(3.5,-3.5) 4(3.5,3.5)
HDR-TH_5P-P2.54-V-M
  rect 1.7x1.7 hole 1.1: 1(-5.08,0)
  round 1.7 hole 1.1: 2(-2.54,0) 3(0,0) 4(2.54,0) 5(5.08,0)
HDR-TH_40P-P2.54-H-F-R2-C20-S2.54-N
  rect 1.6x1.6 hole 1.02: 1(-24.13,-1.27)
  round 1.6 hole 1.02: 2(-24.13,1.27) 3(-21.59,-1.27) 4(-21.59,1.27) 5(-19.05,-1.27) 6(-19.05,1.27) 7(-16.51,-1.27) 8(-16.51,1.27) 9(-13.97,-1.27) 10(-13.97,1.27) 11(-11.43,-1.27) 12(-11.43,1.27) 13(-8.89,-1.27) 14(-8.89,1.27) 15(-6.35,-1.27) 16(-6.35,1.27) 17(-3.81,-1.27) 18(-3.81,1.27) 19(-1.27,-1.27) 20(-1.27,1.27) 21(1.27,-1.27) 22(1.27,1.27) 23(3.81,-1.27) 24(3.81,1.27) 25(6.35,-1.27) 26(6.35,1.27) 27(8.89,-1.27) 28(8.89,1.27) 29(11.43,-1.27) 30(11.43,1.27) 31(13.97,-1.27) 32(13.97,1.27) 33(16.51,-1.27) 34(16.51,1.27) 35(19.05,-1.27) 36(19.05,1.27) 37(21.59,-1.27) 38(21.59,1.27) 39(24.13,-1.27) 40(24.13,1.27)
HDR-TH_40P-P2.54-H-R2-C20-S2.54-W10.0
  rect 1.524x1.524 hole 1.02: 1(-24.13,-1.27)
  round 1.524 hole 1.02: 2(-24.13,1.27) 3(-21.59,-1.27) 4(-21.59,1.27) 5(-19.05,-1.27) 6(-19.05,1.27) 7(-16.51,-1.27) 8(-16.51,1.27) 9(-13.97,-1.27) 10(-13.97,1.27) 11(-11.43,-1.27) 12(-11.43,1.27) 13(-8.89,-1.27) 14(-8.89,1.27) 15(-6.35,-1.27) 16(-6.35,1.27) 17(-3.81,-1.27) 18(-3.81,1.27) 19(-1.27,-1.27) 20(-1.27,1.27) 21(1.27,-1.27) 22(1.27,1.27) 23(3.81,-1.27) 24(3.81,1.27) 25(6.35,-1.27) 26(6.35,1.27) 27(8.89,-1.27) 28(8.89,1.27) 29(11.43,-1.27) 30(11.43,1.27) 31(13.97,-1.27) 32(13.97,1.27) 33(16.51,-1.27) 34(16.51,1.27) 35(19.05,-1.27) 36(19.05,1.27) 37(21.59,-1.27) 38(21.59,1.27) 39(24.13,-1.27) 40(24.13,1.27)
R0603
  rect 0.806x0.864 smd: 1(-0.753,0) 2(0.753,0)
SMC_L6.9-W5.9-LS7.9-R-RD
  rect 2.158x3.24 smd: 1(3.687,0) 2(-3.687,0)

## Nets
As in the schematic.

Pads without a net: H2 29 31 33 35 37 38 39 40; U19 S6 S7; U22 1 2 3 5
